# EAGLE design V2_aktuell_StdTeile_panel_small (EAGLE 6.5.0)

## Sheet 1 of 2
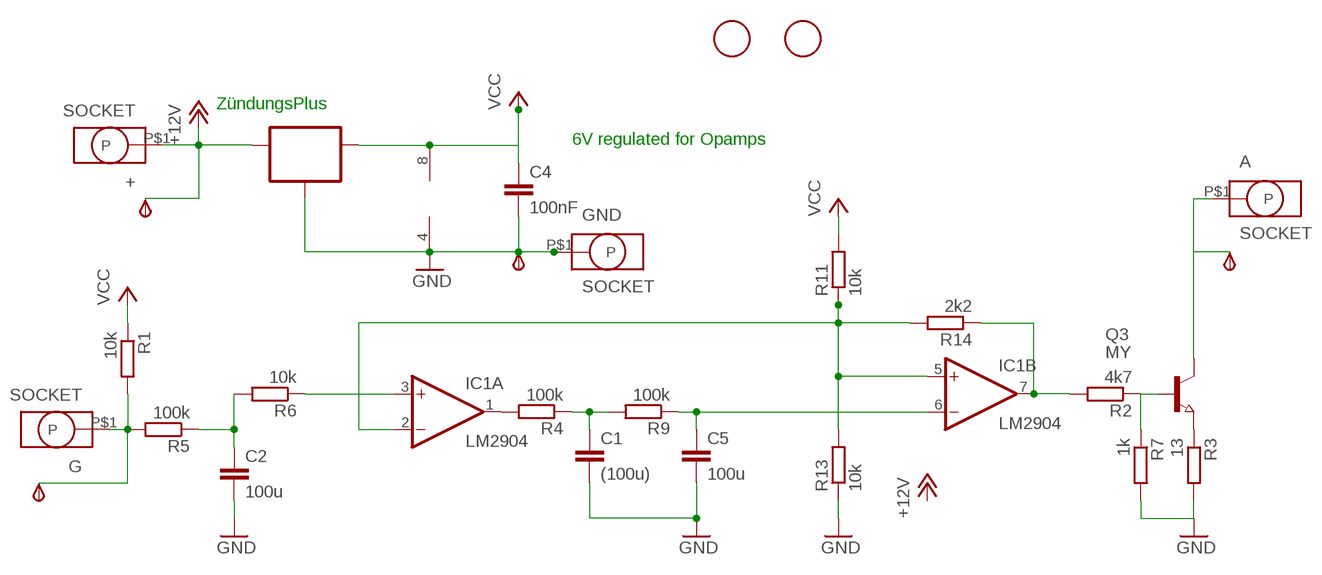
[diagram p0: schematic, sheet 1]

### Parts
+  SOCKET  [ID2.5MM]
A  SOCKET  [ID2.5MM]
C1  (100u)  C-EUC1206K  [C1206K]
C2  100u  C-EUC1206K  [C1206K]
C4  100nF  C-EUC0805  [C0805]
C5  100u  C-EUC1206K  [C1206K]
FID1  FIDUCIALFIDUCIAL_1MM_WITH_SOLDERMASK  [FIDUCIAL_1MM_WITH_SOLDERMASK]
FID2  FIDUCIALFIDUCIAL_1MM_WITH_SOLDERMASK  [FIDUCIAL_1MM_WITH_SOLDERMASK]
G  SOCKET  [ID2.5MM]
GND  SOCKET  [ID2.5MM]
GND_  TPSB2.0  [B2.0]
IC1  LM2904  LM358D  [SO08]
IC2  78L06  78LXXSOT89_ROUND  [SOT89_ROUND]
IN  TPSB2.0  [B2.0]
OUT  TPSB2.0  [B2.0]
Q3  MY  NPN-TRANSISTOR_SOT89  [SOT89]
R1  10k  R-EU_R0805  [R0805]
R2  4k7  R-EU_R0805  [R0805]
R3  13  R-EU_R1206  [R1206]
R4  100k  R-EU_R0805  [R0805]
R5  100k  R-EU_R0805  [R0805]
R6  10k  R-EU_R0805  [R0805]
R7  1k  R-EU_R0805  [R0805]
R9  100k  R-EU_R0805  [R0805]
R11  10k  R-EU_R0805  [R0805]
R13  10k  R-EU_R0805  [R0805]
R14  2k2  R-EU_R0805  [R0805]
V+  TPSB2.0  [B2.0]

### Nets
+12V: +.P$1(P) IC2.3(IN) V+.TP(PP) ; also sheet 2
GND: C1.2 C2.2 C4.2 C5.2 GND.P$1(P) GND_.TP(PP) IC1.4(P:V-) IC2.2(GND) IC2.2@1(GND) R3.2 R7.2 R13.1 ; also sheet 2
N$1: C2.1 R5.1 R6.2
N$2: Q3.1(B) R2.1 R7.1
N$3: C1.1 R4.1 R9.2
N$4: C5.1 IC1.6(B:-IN) R9.1
N$5: IC1.2(A:-IN) IC1.5(B:+IN) R11.1 R13.2 R14.2
N$6: G.P$1(P) IN.TP(PP) R1.2 R5.2
N$7: Q3.3(E) R3.1
N$9: IC1.3(A:+IN) R6.1
N$10: IC1.7(B:OUT) R2.2 R14.1
N$11: A.P$1(P) OUT.TP(PP) Q3.2(C)
N$580: IC1.1(A:OUT) R4.2
VCC: C4.1 IC1.8(P:V+) IC2.1(OUT) R1.1 R11.2 ; also sheet 2

### Notes on the sheet
- ZündungsPlus
- 6V regulated for Opamps

## Sheet 2 of 2
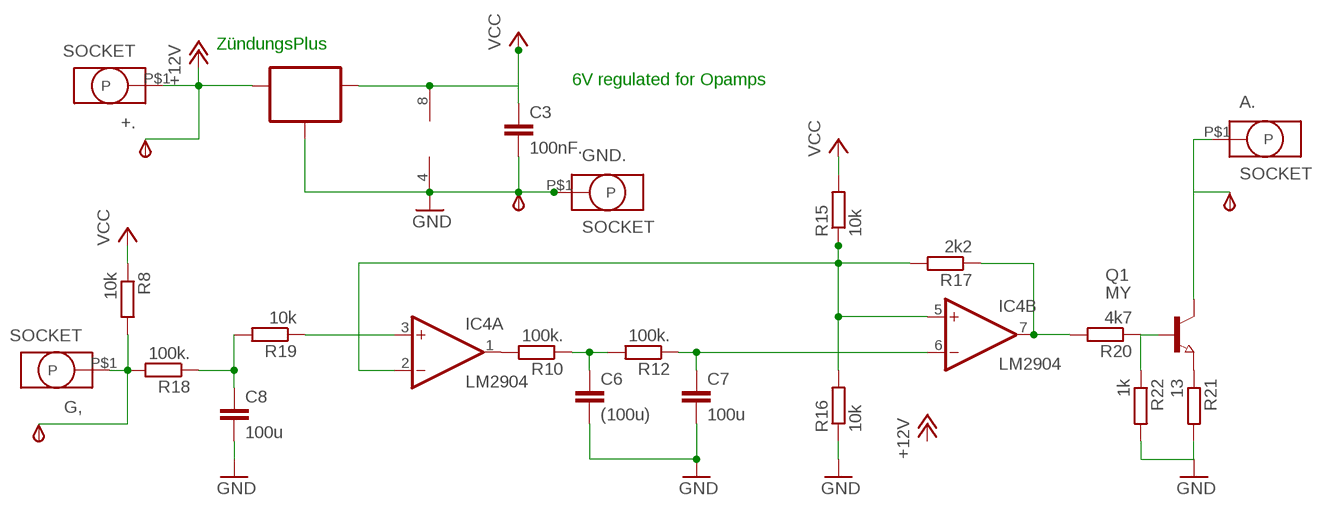
[diagram p1: schematic, sheet 2]

### Parts
+.  SOCKET  [ID2.5MM]
A.  SOCKET  [ID2.5MM]
C3  100nF.  C-EUC0805  [C0805]
C6  (100u)  C-EUC1206K  [C1206K]
C7  100u  C-EUC1206K  [C1206K]
C8  100u  C-EUC1206K  [C1206K]
G,  SOCKET  [ID2.5MM]
GND.  SOCKET  [ID2.5MM]
GND_1  TPSB2.0  [B2.0]
IC3  78L06  78LXXSOT89_ROUND  [SOT89_ROUND]
IC4  LM2904  LM358D  [SO08]
IN.  TPSB2.0  [B2.0]
OUT.  TPSB2.0  [B2.0]
Q1  MY  NPN-TRANSISTOR_SOT89  [SOT89]
R8  10k  R-EU_R0805  [R0805]
R10  100k.  R-EU_R0805  [R0805]
R12  100k.  R-EU_R0805  [R0805]
R15  10k  R-EU_R0805  [R0805]
R16  10k  R-EU_R0805  [R0805]
R17  2k2  R-EU_R0805  [R0805]
R18  100k.  R-EU_R0805  [R0805]
R19  10k  R-EU_R0805  [R0805]
R20  4k7  R-EU_R0805  [R0805]
R21  13  R-EU_R1206  [R1206]
R22  1k  R-EU_R0805  [R0805]
V+.  TPSB2.0  [B2.0]

### Nets
+12V: +..P$1(P) IC3.3(IN) V+..TP(PP) ; also sheet 1
GND: C3.2 C6.2 C7.2 C8.2 GND..P$1(P) GND_1.TP(PP) IC3.2(GND) IC3.2@1(GND) IC4.4(P:V-) R16.1 R21.2 R22.2 ; also sheet 1
N$20: IC4.1(A:OUT) R10.2
N$21: C6.1 R10.1 R12.2
N$22: C7.1 IC4.6(B:-IN) R12.1
N$23: IC4.2(A:-IN) IC4.5(B:+IN) R15.1 R16.2 R17.2
N$24: IC4.7(B:OUT) R17.1 R20.2
N$25: C8.1 R18.1 R19.2
N$26: G,.P$1(P) IN..TP(PP) R8.2 R18.2
N$27: IC4.3(A:+IN) R19.1
N$28: Q1.1(B) R20.1 R22.1
N$29: A..P$1(P) OUT..TP(PP) Q1.2(C)
N$30: Q1.3(E) R21.1
VCC: C3.1 IC3.1(OUT) IC4.8(P:V+) R8.1 R15.2 ; also sheet 1

### Notes on the sheet
- ZündungsPlus
- 6V regulated for Opamps

## Library data of the parts
+ +. A A. G G, GND GND. = Brotbox_Socket_Header:SOCKET
C1-C8 = rcl:C-EU: CAPACITOR, European symbol
FID1 FID2 = Fiducial:FIDUCIAL: For use by pick and place machines to calibrate the vision/machine, 1mm By microbuilder.eu
GND_ GND_1 IN IN. OUT OUT. V+ V+. = testpin_BMW:TPS: TEST PIN
IC1 IC4 = linear_BMW:LM358: OP AMP also LM158; LM258; LM2904 Source: http://cache.national.com/ds/LM/LM158.pdf
IC2 IC3 = 78LXX:78LXX
Q1 Q3 = Transistor_SOT89:NPN-TRANSISTOR_: NPN TRANSISTOR
R1-R22 = rcl:R-EU_: RESISTOR, European symbol

## Board
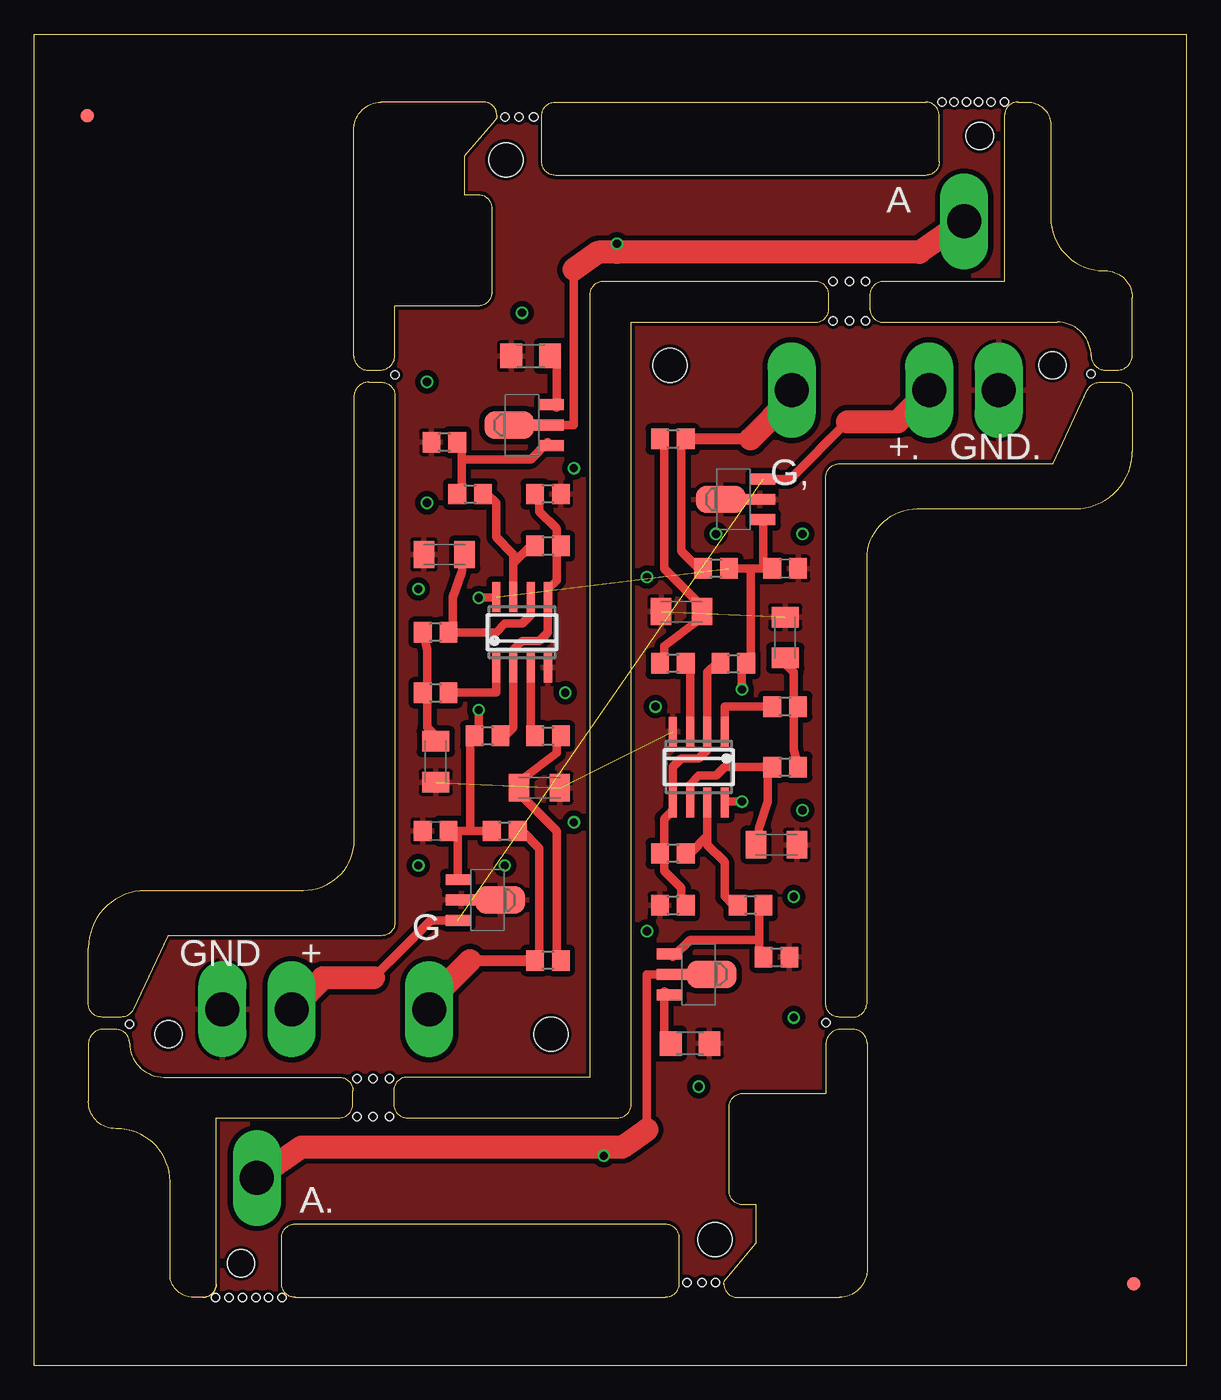
[diagram p2: board, top side]
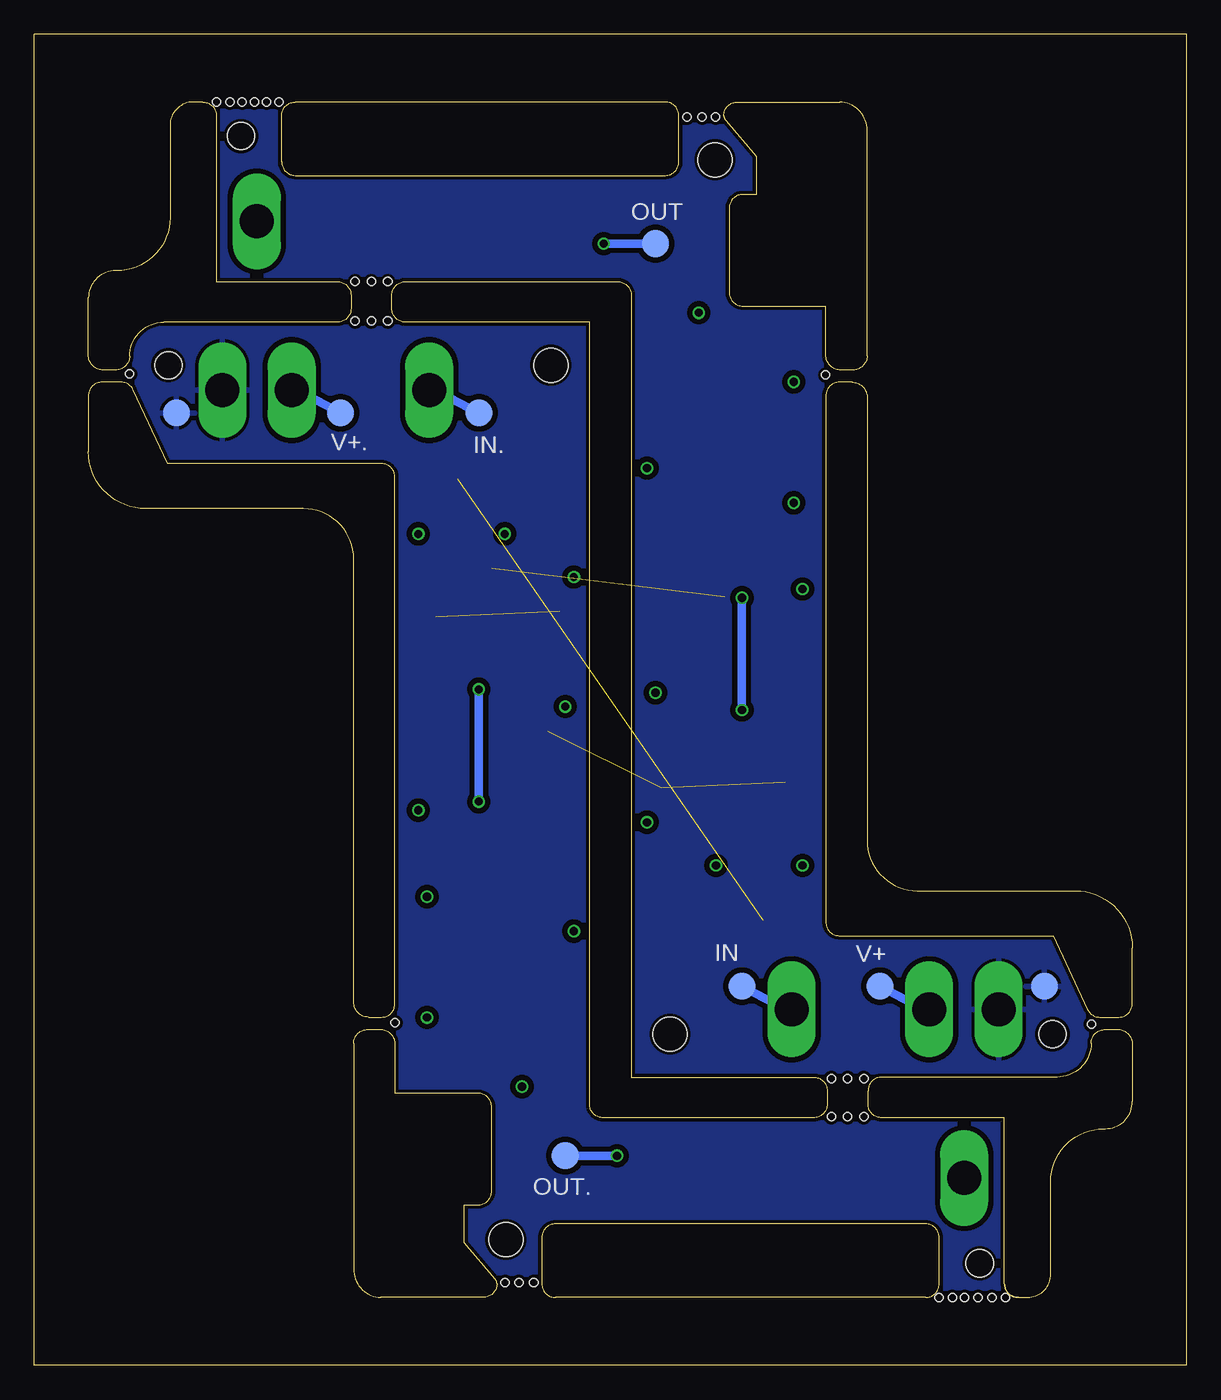
[diagram p3: board, bottom side, seen from below]

Size 84.73 x 97.9 mm. Coordinates in mm from the lower left corner, seen from the top.
Outline: 31.63,88.9 33.9,91.55 arc41 34.03,91.9 arc90 33.03,92.9
Outline: 33.03,92.9 25.5,92.9 arc90 23.5,90.81 23.5,74.23
Outline: 32.63,86.1 arc-90 33.63,85.1
Outline: 33.63,78.9 arc-90 32.63,77.9
Outline: 26.53,32.6 arc-90 25.53,31.6
Outline: 9.56,21.2 22.43,21.2 arc-90 23.43,20.2 23.43,19.21 arc-90 22.43,18.21 13.4,18.21 13.4,6.01
Outline: 47.4,6.21 47.4,9.41 arc90 46.4,10.41 19.2,10.41 arc90 18.2,9.41 18.2,6 arc90 19.2,5 46.4,5 arc90 47.4,6 47.4,9.4
Outline: 13.4,6.01 13.4,6 arc-90 12.4,5
Outline: 61.23,23.7 61.23,23.68
Outline: 61.23,23.68 arc90 60.2,24.71 59.4,24.71 arc90 58.2,23.71 58.2,20.01 52.1,20.01 arc90 51.1,19.01 51.1,12.81 arc90 52.1,11.81 53.1,11.81 53.1,9.01 50.83,6.35 arc41 50.7,6 arc90 51.7,5.01 59.23,5.01 arc90 61.23,7.1 61.23,23.68
Outline: 33.03,92.9 arc-90 34.03,91.91 arc-41 33.9,91.56 31.63,88.9
Outline: 13.4,6.01 arc-90 12.4,5.01 11.7,5.01 arc-90 10,6.71 10,13.51 arc90 6.1,17.41 6,17.41 arc-90 4,19.41 4,23.71 arc-90 5.2,24.71 6,24.71 arc-90 7.03,23.68 7.03,23.7 arc90 9.53,21.2
Outline: 31.63,88.9 31.63,86.1 32.63,86.1
Outline: 32.63,86.1 arc-90 33.63,85.1
Outline: 33.63,85.1 33.63,78.9
Outline: 33.63,78.9 arc-90 32.63,77.9
Outline: 26.53,32.6 arc-90 25.53,31.6
Outline: 25.53,31.6 9.83,31.6 7.3,26.19 arc-65 6.39,25.61 5,25.61 arc-90 4,26.61 4,30.71 arc-90 8.2,34.91 19.8,34.91 arc90 23.5,38.61 23.5,71.21 arc-90 24.6,72.3 25.53,72.3 arc-90 26.53,71.3 26.53,32.6
Outline: 32.63,77.9 26.53,77.9 26.53,74.2 arc-90 25.33,73.2 24.53,73.2 arc-90 23.5,74.23
Outline: 23.5,74.21 23.5,74.23
Outline: 0,97.9 84.73,97.9 84.73,0 0,0 0,97.9
Outline: 66.53,88.5 66.53,91.9 arc90 65.53,92.9 38.33,92.9 arc90 37.33,91.9 37.33,88.5 arc90 38.33,87.5 65.53,87.5 arc90 66.53,88.5
Outline: 62.43,79.7 arc90 61.43,78.7 61.43,77.71 arc90 62.43,76.71 75.2,76.71 arc-90 77.7,74.21 77.7,74.23 arc90 78.73,73.2 79.53,73.2 arc90 80.73,74.2 80.73,78.5 arc90 78.73,80.5 78.63,80.5 arc-90 74.73,84.4 74.73,91.2 arc90 73.03,92.9 72.33,92.9 arc90 71.33,91.9 71.33,79.7 62.43,79.7
Outline: 58.43,77.71 58.43,78.7 arc90 57.43,79.7 41.83,79.7 arc90 40.83,78.7 40.83,21.2 27.43,21.2 arc90 26.43,20.2 26.43,19.21 arc90 27.43,18.21 42.9,18.21 arc90 43.9,19.21 43.9,76.71 57.43,76.71 arc90 58.43,77.71
Outline: 58.2,65.31 arc-90 59.2,66.31 74.9,66.31 77.43,71.72 arc-65 78.34,72.3 79.73,72.3 arc-90 80.73,71.3 80.73,67.2 arc-90 76.53,63 64.93,63 arc90 61.23,59.3 61.23,26.7 arc-90 60.13,25.61 59.2,25.61 arc-90 58.2,26.61 58.2,65.31
Copper layers (1*16): Top 0.035mm / dielectric 1.5mm / Bottom 0.035mm
Design rules "SeeedStudio_2layer_DRU_no_angle_20140221 *": minimum track width 24mil, minimum drill 12mil, track to track 0.4mm, track to pad 0.4mm, pad to pad 0.4mm, via to via 0.4mm, smd to smd 0mil, copper to edge 10mil, drill to drill 10mil, minimum pad ring 10mil, minimum via ring 6mil, stop-mask expansion 2mil, vias tented up to drill 100mil, thermal gap 10mil
Holes 2.5 mm at 37.99,24.37 34.68,88.65 46.74,73.54 50.05,9.26
Holes 2 mm at 69.51,90.39 9.87,24.37 15.22,7.52 74.86,73.54
Holes 0.6 mm at 71.33,92.9 70.33,92.9 69.43,92.9 68.53,92.9 67.63,92.9 66.73,92.9 36.73,91.8 35.63,91.8 34.63,91.8 13.33,5 14.33,5 15.33,5 16.33,5 17.23,5 18.23,5 48,6.1 49.1,6.1 50.1,6.1 58.73,79.7 59.93,79.7 61.13,79.7 59.93,76.8 58.73,76.8 61.13,76.8 23.73,21.1 24.93,21.1 26.13,21.1 23.73,18.3 24.93,18.3 26.13,18.3 58.2,25.2 77.7,72.9 26.54,72.83 7.02,25.1
Milling: 185 lines

### Footprints (pad centres in the part's own frame; a part is rotated, then mirrored left to right if it is on the bottom)
ID2.5MM = drill 2.5 long: P$1 0,0
C1206K = smd 1.5 x 2: 1 -1.5,0; 2 1.5,0
C0805 = smd 1.3 x 1.5: 1 -0.95,0; 2 0.95,0
FIDUCIAL_1MM_WITH_SOLDERMASK = smd 1 x 1: 1 0,0
B2.0 = smd 2 x 2: TP 0,0
SO08 = smd 0.6 x 2.2: 1 -1.905,-2.6; 2 -0.635,-2.6; 3 0.635,-2.6; 4 1.905,-2.6; 5 1.905,2.6; 6 0.635,2.6; 7 -0.635,2.6; 8 -1.905,2.6
SOT89_ROUND = smd 0.8 x 1.8: 1 -1.499,-2.181; 3 1.499,-2.181 | smd 0.8 x 2.3: 2 0,-1.927 | smd 2.032 x 3.65: 2@1 0,0.94
SOT89 = smd 0.8 x 1.8: 1 -1.499,-2.181; 3 1.499,-2.181 | smd 0.8 x 2.3: 2 0,-1.927 | smd 2.032 x 3.65: 2@1 0,0.94
R0805 = smd 1.3 x 1.5: 1 -0.95,0; 2 0.95,0
R1206 = smd 1.6 x 1.803: 1 -1.422,0; 2 1.422,0

### Placement (x,y rotation side)
+  18.94,26.19 90 top
+.  65.79,71.72 270 top
A  68.36,84.12 90 top
A.  16.37,13.79 270 top
C1  29.52,44.38 270 top
C2  37.14,42.48 0 top
C3  55.21,58.6 0 top
C4  29.52,39.3 180 top
C5  30.16,59.62 180 top
C6  55.21,53.52 90 top
C7  54.58,38.28 0 top
C8  47.59,55.43 180 top
FID1  3.9,91.91 0 top
FID2  80.83,6 0 top
G  29.04,26.19 90 top
G,  55.69,71.72 270 top
GND  13.84,26.19 90 top
GND.  70.89,71.72 270 top
GND_  10.47,27.88 0 bottom
GND_1  74.26,70.04 180 bottom
IC1  35.87,53.91 0 top
IC2  33.33,34.23 270 top
IC3  51.4,63.68 90 top
IC4  48.86,44 180 top
IN  32.7,27.88 0 bottom
IN.  52.03,70.04 180 bottom
OUT  39.05,82.48 0 bottom
OUT.  45.69,15.43 180 bottom
Q1  48.86,28.76 270 top
Q3  35.87,69.15 90 top
R1  34.6,39.3 0 top
R2  32.06,64.07 0 top
R3  36.5,74.23 180 top
R4  29.52,49.46 0 top
R5  37.77,29.78 180 top
R6  37.77,46.29 0 top
R7  30.16,67.88 180 top
R8  50.13,58.6 180 top
R9  29.52,53.91 180 top
R10  55.21,48.45 180 top
R11  33.33,46.29 180 top
R12  55.21,44 0 top
R13  37.77,64.07 180 top
R14  37.77,60.26 0 top
R15  51.4,51.62 0 top
R16  46.95,33.84 0 top
R17  46.95,37.65 180 top
R18  46.95,68.13 0 top
R19  46.95,51.62 180 top
R20  52.67,33.84 180 top
R21  48.23,23.68 0 top
R22  54.58,30.03 0 top
V+  22.54,27.88 0 bottom
V+.  62.2,70.04 180 bottom

### Tracks (layer width: path | path; a pad name or v marks a point on that pad's centre or on a via)
+12V  (1 unrouted)
  Top 0.61: IC2.3 29.16,32.73 24.95,28.51 | IC3.3 55.57,65.18 59.78,69.4
  Top 1.676: 24.95,28.51 21.26,28.51 +.P$1 | 59.78,69.4 63.47,69.4 +..P$1
  Bottom 0.61: V+.TP 18.94,25.97 +.P$1 | V+..TP 65.79,71.94 +..P$1
GND  (3 unrouted)
  pour Bottom: 6.66,20.89 40.95,20.89 40.95,79.56 71.43,79.56 71.43,93.92 32.7,93.92 25.71,78.04 25.71,34.86 23.8,32.32 7.29,32.32
  pour Top: 6.66,20.89 40.95,20.89 40.95,79.82 71.43,79.82 71.43,93.92 32.7,93.92 26.34,78.04 25.71,34.86 23.17,32.32 6.66,32.32
  pour Bottom: 78.07,77.02 43.78,77.02 43.78,18.35 13.3,18.35 13.3,4 52.03,4 59.02,19.87 59.02,63.05 60.92,65.59 77.44,65.59
  pour Top: 78.07,77.02 43.78,77.02 43.78,18.09 13.3,18.09 13.3,4 52.03,4 58.38,19.87 59.02,63.05 61.56,65.59 78.07,65.59
N$1
  Top 0.61: 35.87,42.48 35.87,41.84 38.41,39.3 38.41,29.78 R5.1 | 35.87,42.48 35.87,43.12 38.41,45.02 38.41,46.29 R6.2 | 35.87,42.48 C2.1
N$2
  Top 0.61: 31.43,66.61 31.43,64.07 R2.1 | 31.43,66.61 31.43,67.88 R7.1 | 31.43,66.61 36.5,66.61 37.77,67.88 Q3.1
N$3
  Top 0.61: 28.88,49.46 28.88,52.64 R9.2 | 28.88,49.46 28.88,46.92 29.52,46.29 C1.1 | 28.88,49.46 R4.1
N$4
  Top 0.61: IC1.6 36.5,55.18 35.87,54.55 34.6,54.55 33.97,53.91 R9.1 30.79,54.55 30.79,56.45 31.43,58.35 C5.1
N$5
  Top 0.61: R11.1 34.6,46.29 35.23,46.92 IC1.2 35.23,52.64 35.87,53.27 37.14,53.27 37.77,53.91 IC1.5 37.77,57.09 38.41,57.72 38.41,60.26 | 38.41,60.26 38.41,61.53 37.14,62.8 37.14,64.07 R13.2 | 38.41,60.26 R14.2
N$6
  Top 0.61: R1.2 35.87,39.3 37.14,38.03 37.14,29.78 R5.2
  Top 0.813: 32.06,29.78 R5.2
  Top 1.676: G.P$1 29.04,26.76 32.06,29.78
  Bottom 0.61: IN.TP 29.04,25.97 G.P$1
N$7
  Top 0.61: Q3.3 38.41,70.42 38.41,74.23 R3.1
N$8  (via drill 0.6)
  other vias: 34.6,36.77
N$9
  Top 0.61: IC1.3 36.5,46.29 R6.1
N$10
  Top 0.61: IC1.7 35.23,58.99 | 35.23,58.99 35.23,59.62 33.97,60.89 33.97,63.43 33.33,64.07 R2.2 | 35.23,58.99 36.5,60.26 R14.1
N$11  (via drill 0.6)
  Top 0.61: Q3.2 39.68,69.15 39.68,80.58 | v42.85,82.48 42.85,81.85
  Top 1.676: A.P$1 65.08,81.85 42.85,81.85 41.46,81.85 39.68,80.58
  Bottom 0.61: OUT.TP v42.85,82.48
N$12  (via drill 0.6)
  other vias: 39.05,49.46
N$13  (via drill 0.6)
  other vias: 28.88,63.43
N$14  (via drill 0.6)
  other vias: 28.88,72.33
N$15  (via drill 0.6)
  other vias: 35.87,77.41
N$16  (via drill 0.6)
  other vias: 39.68,65.98
N$17  (via drill 0.6)
  other vias: 39.68,39.94
N$18  (via drill 0.6)
  other vias: 28.25,36.77
N$19  (via drill 0.6)
  other vias: 28.25,57.09
N$20
  Top 0.61: R10.2 50.77,48.45 IC4.1
N$21
  Top 0.61: 55.84,48.45 55.84,45.27 R12.2 | 55.84,48.45 55.84,50.98 55.21,51.62 C6.1 | 55.84,48.45 R10.1
N$22
  Top 0.61: IC4.6 48.23,42.73 48.86,43.37 50.13,43.37 50.77,44 R12.1 53.94,43.37 53.94,41.46 53.3,39.55 C7.1
N$23
  Top 0.61: R15.1 50.13,51.62 49.49,50.98 IC4.2 49.49,45.27 48.86,44.63 47.59,44.63 46.95,44 IC4.5 46.95,40.82 46.32,40.19 46.32,37.65 | 46.32,37.65 46.32,36.38 47.59,35.11 47.59,33.84 R16.2 | 46.32,37.65 R17.2
N$24
  Top 0.61: IC4.7 49.49,38.92 | 49.49,38.92 49.49,38.28 50.77,37.02 50.77,34.48 51.4,33.84 R20.2 | 49.49,38.92 48.23,37.65 R17.1
N$25
  Top 0.61: 48.86,55.43 48.86,56.06 46.32,58.6 46.32,68.13 R18.1 | 48.86,55.43 48.86,54.8 46.32,52.89 46.32,51.62 R19.2 | 48.86,55.43 C8.1
N$26
  Top 0.61: R8.2 48.86,58.6 47.59,59.88 47.59,68.13 R18.2
  Top 0.813: 52.67,68.13 R18.2
  Top 1.676: G,.P$1 55.69,71.15 52.67,68.13
  Bottom 0.61: IN..TP 55.69,71.94 G,.P$1
N$27
  Top 0.61: IC4.3 48.23,51.62 R19.1
N$28
  Top 0.61: 53.3,31.3 53.3,33.84 R20.1 | 53.3,31.3 53.3,30.03 R22.1 | 53.3,31.3 48.23,31.3 46.95,30.03 Q1.1
N$29  (via drill 0.6)
  Top 0.61: Q1.2 45.05,28.76 45.05,17.33 | v41.88,15.43 41.88,16.06
  Top 1.676: A..P$1 19.65,16.06 41.88,16.06 43.27,16.06 45.05,17.33
  Bottom 0.61: OUT..TP v41.88,15.43
N$30
  Top 0.61: Q1.3 46.32,27.49 46.32,23.68 R21.1
N$31  (via drill 0.6)
  other vias: 50.13,61.14
N$32  (via drill 0.6)
  other vias: 45.69,48.45
N$33  (via drill 0.6)
  other vias: 55.84,34.48
N$34  (via drill 0.6)
  other vias: 55.84,25.59
N$35  (via drill 0.6)
  other vias: 48.86,20.51
N$36  (via drill 0.6)
  other vias: 45.05,31.94
N$37  (via drill 0.6)
  other vias: 45.05,57.97
N$38  (via drill 0.6)
  other vias: 56.48,61.14
N$39  (via drill 0.6)
  other vias: 56.48,40.82
N$580
  Top 0.61: R4.2 33.97,49.46 IC1.1
VCC  (via drill 0.6)  (1 unrouted)
  Top 0.61: C4.1 31.15,39.3 | 31.15,39.3 IC2.1 | R1.1 32.06,39.3 | 32.06,39.3 31.15,39.3 | 32.06,39.3 32.06,46.29 R11.2 32.7,46.29 v32.7,48.2 | v32.7,56.45 33.91,56.45 IC1.8 | C3.1 53.58,58.6 | 53.58,58.6 IC3.1 | R8.1 52.67,58.6 | 52.67,58.6 53.58,58.6 | 52.67,58.6 52.67,51.62 R15.2 52.03,51.62 v52.03,49.71 | v52.03,41.46 50.83,41.46 IC4.8
  Bottom 0.61: v32.7,48.2 v32.7,56.45 | v52.03,49.71 v52.03,41.46